# EAGLE design E6_main (EAGLE 7.0.0)
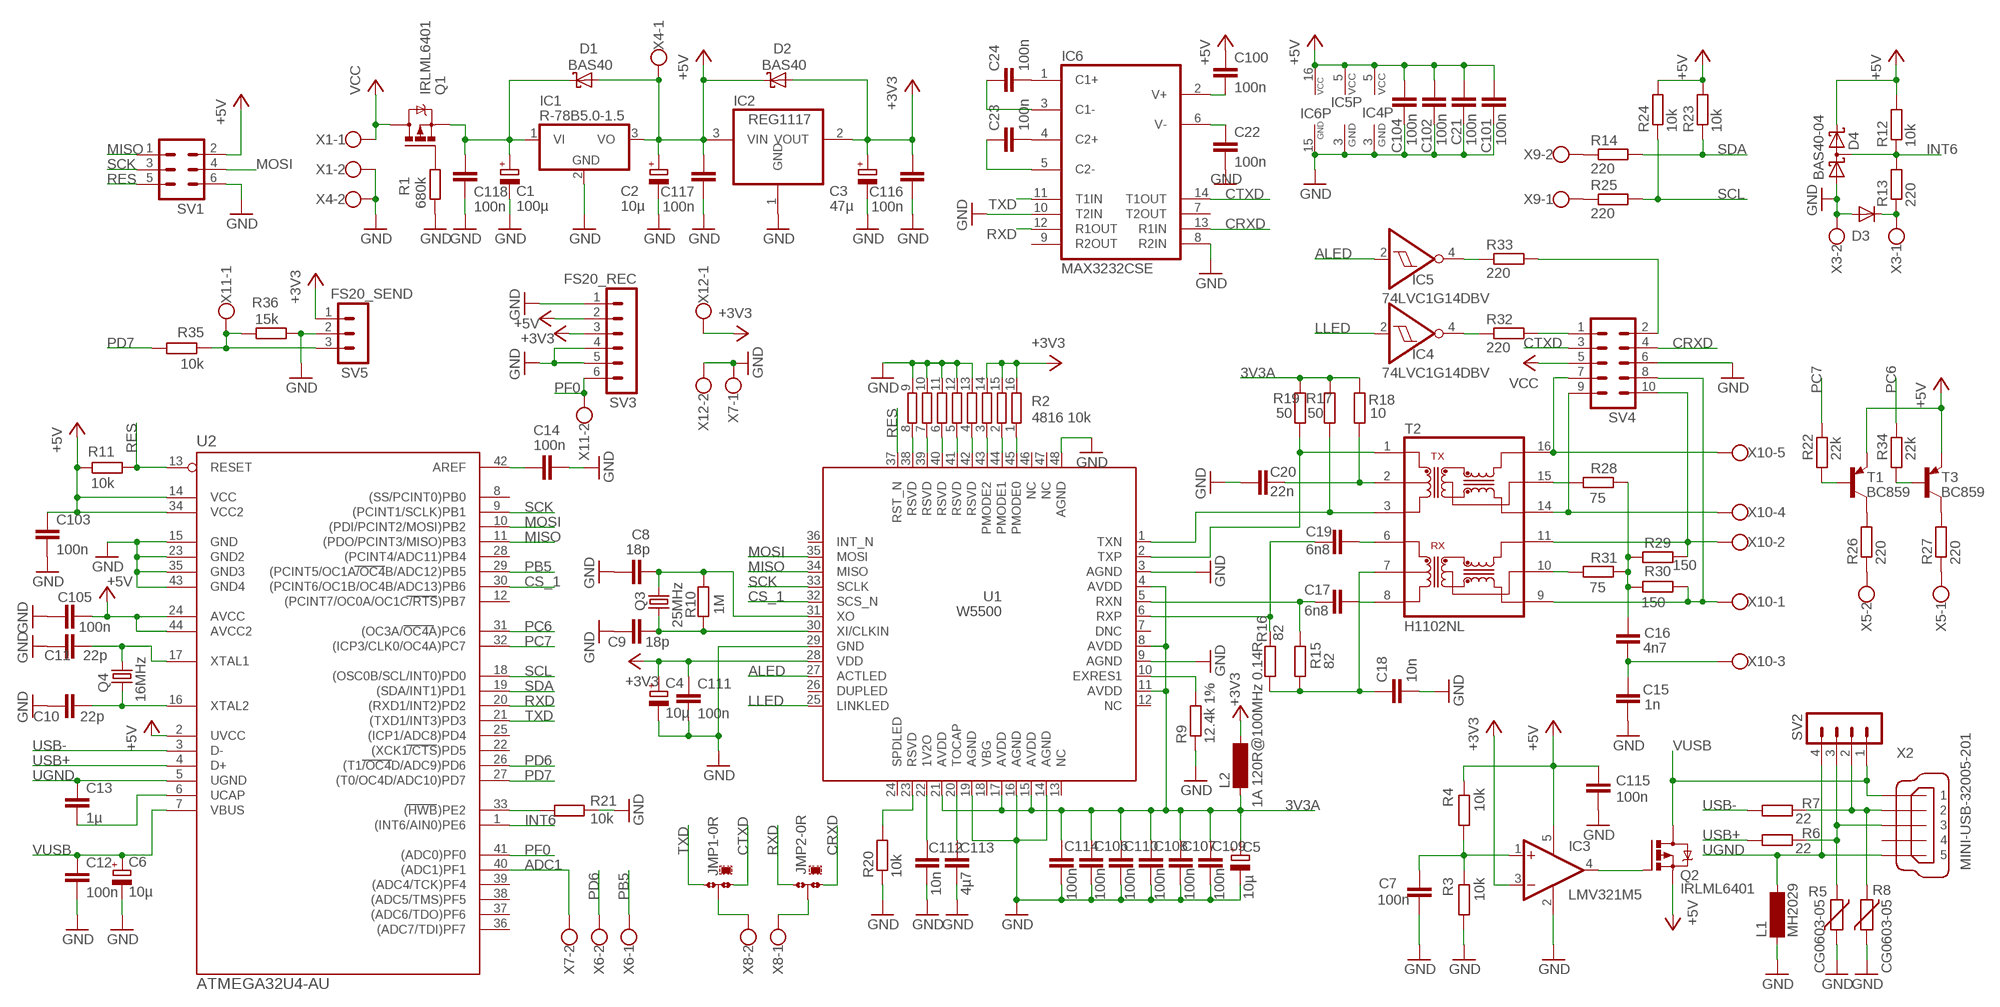
[diagram p0: schematic, sheet 1]

## Parts
C1  100µ  CPOL-EUE2.5-7  [E2,5-7]
C2  10µ  CPOL-EUE2-5  [E2-5]
C3  47µ  CPOL-EUE2-5  [E2-5]
C4  10µ  CPOL-EUE2-5  [E2-5]
C5  10µ  CPOL-EUE2-5  [E2-5]
C6  10µ  CPOL-EUE2-5  [E2-5]
C7  100n  C-EUC0805K  [C0805K]
C8  18p  C-EUC0805K  [C0805K]
C9  18p  C-EUC0805K  [C0805K]
C10  22p  C-EUC0805K  [C0805K]
C11  22p  C-EUC0805K  [C0805K]
C12  100n  C-EUC0805K  [C0805K]
C13  1µ  C-EUC0805K  [C0805K]
C14  100n  C-EUC0805K  [C0805K]
C15  1n  C-EUC0805K  [C0805K]
C16  4n7  C-EUC0805K  [C0805K]
C17  6n8  C-EUC0805K  [C0805K]
C18  10n  C-EUC0805K  [C0805K]
C19  6n8  C-EUC0805K  [C0805K]
C20  22n  C-EUC0805K  [C0805K]
C21  100n  C-EUC0805K  [C0805K]
C22  100n  C-EUC0805K  [C0805K]
C23  100n  C-EUC0805K  [C0805K]
C24  100n  C-EUC0805K  [C0805K]
C100  100n  C-EUC0805K  [C0805K]
C101  100n  C-EUC0805K  [C0805K]
C102  100n  C-EUC0805K  [C0805K]
C103  100n  C-EUC0805K  [C0805K]
C104  100n  C-EUC0805K  [C0805K]
C105  100n  C-EUC0805K  [C0805K]
C106  100n  C-EUC0805K  [C0805K]
C107  100n  C-EUC0805K  [C0805K]
C108  100n  C-EUC0805K  [C0805K]
C109  100n  C-EUC0805K  [C0805K]
C110  100n  C-EUC0805K  [C0805K]
C111  100n  C-EUC0805K  [C0805K]
C112  10n  C-EUC0805K  [C0805K]
C113  4µ7  C-EUC0805K  [C0805K]
C114  100n  C-EUC0805K  [C0805K]
C115  100n  C-EUC0805K  [C0805K]
C116  100n  C-EUC0805K  [C0805K]
C117  100n  C-EUC0805K  [C0805K]
C118  100n  C-EUC0805K  [C0805K]
D1  BAS40  [SOT23]
D2  BAS40  [SOT23]
D3  DIODE-SOT54H  [SOT54H]
D4  BAS40-04  [SOT23]
IC1  R-78B5.0-1.5  7805TV  [TO220V]
IC2  REG1117  [SOT223]
IC3  LMV321M5  [SOT23-5]
IC4  74LVC1G14DBV  [SOT23-5]
IC5  74LVC1G14DBV  [SOT23-5]
IC6  MAX3232CSE  [SO16]
JMP1  0R-JUMPA  [A0R-JMP]
JMP2  0R-JUMPA  [A0R-JMP]
L1  MH2029  SM-1206  [SM-1206]
L2  1A 120R@100MHz 0.14R  SM-1206  [SM-1206]
Q1  IRLML6401  IRLML5203  [MICRO3]
Q2  IRLML6401  IRLML5203  [MICRO3]
Q3  25MHz  CRYSTALHC49S  [HC49/S]
Q4  16MHz  CRYSTALHC49S  [HC49/S]
R1  680k  R-EU_R0805  [R0805]
R2  4816 10k  4816P-T01  [4816P]
R3  10k  R-EU_R0805  [R0805]
R4  10k  R-EU_R0805  [R0805]
R5  CG0603-05  VARISTORCN0603  [CT/CN0603]
R6  22  R-EU_R0805  [R0805]
R7  22  R-EU_R0805  [R0805]
R8  CG0603-05  VARISTORCN0603  [CT/CN0603]
R9  12.4k 1%  R-EU_R0805  [R0805]
R10  1M  R-EU_R0805  [R0805]
R11  10k  R-EU_R0805  [R0805]
R12  10k  R-EU_R0805  [R0805]
R13  220  R-EU_R0805  [R0805]
R14  220  R-EU_R0805  [R0805]
R15  82  R-EU_R0805  [R0805]
R16  82  R-EU_R0805  [R0805]
R17  50  R-EU_R0805  [R0805]
R18  10  R-EU_R0805  [R0805]
R19  50  R-EU_R0805  [R0805]
R20  10k  R-EU_R0805  [R0805]
R21  10k  R-EU_R0805  [R0805]
R22  22k  R-EU_R0805  [R0805]
R23  10k  R-EU_R0805  [R0805]
R24  10k  R-EU_R0805  [R0805]
R25  220  R-EU_R0805  [R0805]
R26  220  R-EU_R0805  [R0805]
R27  220  R-EU_R0805  [R0805]
R28  75  R-EU_R0805  [R0805]
R29  150  R-EU_R0805  [R0805]
R30  150  R-EU_R0805  [R0805]
R31  75  R-EU_R0805  [R0805]
R32  220  R-EU_R0805  [R0805]
R33  220  R-EU_R0805  [R0805]
R34  22k  R-EU_R0805  [R0805]
R35  10k  R-EU_R0805  [R0805]
R36  15k  R-EU_R0805  [R0805]
SV1  ML6  [ML6]
SV2  MA04-1  [MA04-1]
SV3  FS20_REC  MA06-1  [MA06-1]
SV4  ML10  [ML10]
SV5  FS20_SEND  MA03-1  [MA03-1]
T1  BC859  BC857A-PNP-SOT23-BEC  [SOT23-BEC]
T2  H1102NL  HX1188  [HXXXX]
T3  BC859  BC857A-PNP-SOT23-BEC  [SOT23-BEC]
U1  W5500  [W5500]
U2  ATMEGA32U4-AU  [TQFP44]
X1  W237-02P  [W237-132]
X2  MINI-USB-32005-201  [32005-201]
X3  W237-02P  [W237-132]
X4  W237-02P  [W237-132]
X5  W237-02P  [W237-132]
X6  W237-02P  [W237-132]
X7  W237-02P  [W237-132]
X8  W237-02P  [W237-132]
X9  W237-02P  [W237-132]
X10  W237-05P  [W237-5P]
X11  W237-02P  [W237-132]
X12  W237-02P  [W237-132]

## Nets
3V3A: C5.+ C106.1 C107.1 C108.1 C109.1 C110.1 C114.1 L2.1 R17.2 R18.2 R19.2 U1.4(AVDD) U1.8(AVDD) U1.11(AVDD) U1.15(AVDD) U1.17(AVDD) U1.21(AVDD)
+3V3: C3.+ C4.+ C111.1 C116.2 D2.1(A) IC2.2(VOUT) IC3.3(-IN) L2.2 R2.14 R2.15 R2.16 SV3.3 SV5.1 U1.28(VDD) X12.1
+5V: C2.+ C21.1 C100.1 C101.1 C102.2 C103.1 C104.2 C105.1 C115.2 C117.2 D1.1(A) D2.3(C) D4.2(C2) IC1.3(VO) IC2.3(VIN) IC3.5(V+) IC4.5(VCC) IC5.5(VCC) IC6.16(VCC) Q2.2(S) R4.1 R11.2 R12.2 R23.2 R24.2 SV1.2 SV3.2 T1.E T3.E U2.2(UVCC) U2.14(VCC) U2.24(AVCC) U2.34(VCC2) U2.44(AVCC2) X4.1
ADC1: U2.40((ADC1)PF1) X7.2
ALED: IC5.2(I) U1.27(ACTLED)
CRXD: IC6.13(R1IN) JMP2.1 SV4.4
CS_1: U1.32(SCS_N) U2.30((PCINT6/OC1B/OC4B/ADC13)PB6)
CTXD: IC6.14(T1OUT) JMP1.1 SV4.3
GND: C1.- C2.- C3.- C4.- C5.- C6.- C7.2 C8.1 C9.2 C10.2 C11.1 C12.2 C14.2 C15.1 C18.2 C20.1 C21.2 C22.2 C101.2 C102.1 C103.2 C104.1 C105.2 C106.2 C107.2 C108.2 C109.2 C110.2 C111.2 C112.2 C113.2 C114.2 C115.1 C116.1 C117.1 C118.2 D3.A D4.1(A1) IC1.2(GND) IC2.1(GND) IC3.2(V-) IC4.3(GND) IC5.3(GND) IC6.8(R2IN) IC6.10(T2IN) IC6.15(GND) L1.1 R1.2 R2.9 R2.10 R2.11 R2.12 R2.13 R3.2 R5.2 R8.2 R9.1 R20.1 R21.2 R36.1 SV1.6 SV3.1 SV3.4 SV3.5 SV4.6 SV5.2 U1.3(AGND) U1.9(AGND) U1.14(AGND) U1.16(AGND) U1.19(AGND) U1.29(GND) U1.48(AGND) U2.15(GND) U2.23(GND2) U2.35(GND3) U2.43(GND4) X1.2 X3.2 X4.2 X7.1 X12.2
INT6: D4.3(C1A2) R12.1 R13.2 U2.1((INT6/AIN0)PE6)
LLED: IC4.2(I) U1.25(LINKLED)
MISO: SV1.1 U1.34(MISO) U2.11((PDO/PCINT3/MISO)PB3)
MOSI: SV1.4 U1.35(MOSI) U2.10((PDI/PCINT2/MOSI)PB2)
N$1: C10.1 Q4.2 U2.16(XTAL2)
N$2: C11.2 Q4.1 U2.17(XTAL1)
N$3: C17.1 R15.1 U1.5(RXN)
N$4: C1.+ C118.1 D1.3(C) IC1.1(VI) Q1.2(S)
N$5: C113.1 U1.20(TOCAP)
N$6: C19.1 R16.1 U1.6(RXP)
N$7: C9.1 Q3.2 R10.2 U1.30(XI/CLKIN)
N$8: R35.1 R36.2 SV5.3 X11.1
N$9: JMP1.2 X8.2
N$10: C20.2 R18.1 T2.2
N$11: Q1.1(G) R1.1
N$12: C8.2 Q3.1 R10.1 U1.31(XO)
N$13: R19.1 T2.1 U1.2(TXP)
N$14: R2.8 U1.38(RSVD)
N$15: R20.2 U1.23(RSVD)
N$16: C18.1 R15.2 R16.2 T2.7
N$17: R17.1 T2.3 U1.1(TXN)
N$18: C19.2 T2.6
N$19: SV4.7 T2.16 X10.5
N$20: C112.1 U1.22(1V2O)
N$21: SV4.9 T2.14 X10.4
N$22: R29.1 SV4.10 T2.11 X10.2
N$23: R28.2 T2.15
N$24: C15.2 C16.1 X10.3
N$25: R2.7 U1.39(RSVD)
N$26: JMP2.2 X8.1
N$27: R33.2 SV4.2
N$28: R9.2 U1.10(EXRES1)
N$29: C14.1 U2.42(AREF)
N$30: R2.6 U1.40(RSVD)
N$31: R2.5 U1.41(RSVD)
N$32: R2.4 U1.42(RSVD)
N$33: C17.2 T2.8
N$34: R2.3 U1.43(PMODE2)
N$35: R2.2 U1.44(PMODE1)
N$36: R2.1 U1.45(PMODE0)
N$37: C16.2 R28.1 R29.2 R30.2 R31.1
N$38: D3.C R13.1 X3.1
N$39: R31.2 T2.10
N$40: R30.1 SV4.8 T2.9 X10.1
N$41: IC5.4(O) R33.1
N$42: IC4.4(O) R32.1
N$43: R21.1 U2.33((HWB)PE2)
N$44: R26.1 X5.2
N$45: R32.2 SV4.1
N$46: R27.1 X5.1
N$48: C24.1 IC6.3(C1-)
N$49: R7.1 R8.1 SV2.2 X2.2
N$50: C24.2 IC6.1(C1+)
N$51: C23.2 IC6.4(C2+)
N$52: C23.1 IC6.5(C2-)
N$53: C22.1 IC6.6(V-)
N$54: C100.2 IC6.2(V+)
N$55: R26.2 T1.C
N$56: R5.1 R6.1 SV2.3 X2.3
N$57: R27.2 T3.C
N$58: R22.1 T1.B
N$59: R34.1 T3.B
N$61: C13.2 U2.6(UCAP)
N$63: C7.1 IC3.1(+IN) R3.1 R4.2
N$67: IC3.4(OUT) Q2.1(G)
N$173: R14.1 X9.2
N$178: R25.1 X9.1
PB5: U2.29((PCINT5/OC1A/OC4B/ADC12)PB5) X6.1
PC6: R34.2 U2.31((OC3A/OC4A)PC6)
PC7: R22.2 U2.32((ICP3/CLK0/OC4A)PC7)
PD6: U2.26((T1/OC4D/ADC9)PD6) X6.2
PD7: R35.2 U2.27((T0/OC4D/ADC10)PD7)
PF0: SV3.6 U2.41((ADC0)PF0) X11.2
RES: R11.1 SV1.5 U1.37(RST_N) U2.13(RESET)
RXD: IC6.12(R1OUT) JMP2.3 U2.20((RXD1/INT2)PD2)
SCK: SV1.3 U1.33(SCLK) U2.9((PCINT1/SCLK)PB1)
SCL: R24.1 R25.2 U2.18((OSC0B/SCL/INT0)PD0)
SDA: R14.2 R23.1 U2.19((SDA/INT1)PD1)
TXD: IC6.11(T1IN) JMP1.3 U2.21((TXD1/INT3)PD3)
UGND: C13.1 L1.2 SV2.4 U2.5(UGND) X2.5
USB+: R6.2 U2.4(D+)
USB-: R7.2 U2.3(D-)
VCC: Q1.3(D) SV4.5 X1.1
VUSB: C6.+ C12.1 Q2.3(D) SV2.1 U2.7(VBUS) X2.1
Unconnected: IC6.7(T2OUT) IC6.9(R2OUT) U1.7(DNC) U1.12(NC) U1.13(NC) U1.18(VBG) U1.24(SPDLED) U1.26(DUPLED) U1.36(INT_N) U1.46(NC) U1.47(NC) U2.8((SS/PCINT0)PB0) U2.12((PCINT7/OC0A/OC1C/RTS)PB7) U2.22((XCK1/CTS)PD5) U2.25((ICP1/ADC8)PD4) U2.28((PCINT4/ADC11)PB4) U2.36((ADC7/TDI)PF7) U2.37((ADC6/TDO)PF6) U2.38((ADC5/TMS)PF5) U2.39((ADC4/TCK)PF4) X2.4

## Library data of the parts
C1-C6 = rcl:CPOL-EU: POLARIZED CAPACITOR, European symbol
C7-C24 C100-C118 = rcl:C-EU: CAPACITOR, European symbol
D1 D2 = diode:BAS40: Silicon Schottky Diodes General-purpose diode for high-speed switching
D3 = diode:DIODE-: DIODE
D4 = diode:BAS40-04: Silicon Schottky Diodes General-purpose diode for high-speed switching
IC1 = linear:78*: Positive VOLTAGE REGULATOR Source: http://cache.national.com/ds/LM/LM78L05.pdf http://www.fairchildsemi.com/ds/LM/LM7805.pdf
IC2 = burr-brown:REG1117: 800mA and 1A Low Dropout (LDO) Positive Regulator 1.8V, 2.5V, 2.85V, 3.3V, 5V, and Adj
IC3 = linear:LMV321?*: General Purpose, Low Voltage, Rail-to-Rail Output Operational Amplifiers Source: http://www.national.com/mpf/LM/LMV321.html http://www.national.com/dt/lmv_qual.pdf
IC4 IC5 = 74xx-little-de:74*1G14: Single Schmitt-Trigger Inverter Gate
IC6 = maxim:MAX3232*: True RS-232 Transceivers 3.0V to 5.5V, Low-Power up to 1Mbps, Using Four 0.1µF External Capacitors Source: http://pdfserv.maxim-ic.com/en/ds/MAX3222-MAX3241.pdf
JMP1 JMP2 = jump-0r-smd:0R-JUMP: SMD 0R 0805 Jumper
L1 L2 = inductor-neosid:SM-1206: INDUCTOR SMD chip inductor; OC_FARNELL: unknown; OC_NEWARK: unknown
Q1 Q2 = transistor-power:IRLML5203: HEXFET P-Channel Power MOSFET
Q3 Q4 = crystal:CRYSTAL: CRYSTAL
R1 R3 R4 R6 R7 R9-R36 = rcl:R-EU_: RESISTOR, European symbol
R2 = resistor-bourns:4816P-T01: BOURNS RESISTOR NETWORK; MF: BOURNS, INC.; MPN: 4816P-T01-684LF; OC_FARNELL: 9357483; OC_NEWARK: 33K0707
R5 R8 = varistor:VARISTOR: VARISTOR
SV1 = con-ml:ML6: HARTING
SV2 = con-lstb:MA04-1: PIN HEADER; OC_FARNELL: unknown; OC_NEWARK: unknown
SV3 = con-lstb:MA06-1: PIN HEADER
SV4 = con-harting-ml:ML10: HARTING
SV5 = con-lstb:MA03-1: PIN HEADER
T1 T3 = transistor:*-PNP-: PNP Transistror
T2 = pulse-eng:HX1188: Transformer- H110X, H1121, HX1188
U1 = W5500:W5500
U2 = mega32U4:ATMEGA32U4-AU: ATMega32U4-AU Library by: http://projects.weber-itam.de
X1 X3-X9 X11 X12 = con-wago-508:W237-02P: WAGO SREW CLAMP
X2 = con-cypressindustries:MINI-USB-: MINI USB-B Conector Source: www.cypressindustries.com; OC_FARNELL: unknown; OC_NEWARK: unknown
X10 = con-wago-508:W237-05P: WAGO SREW CLAMP

## Board
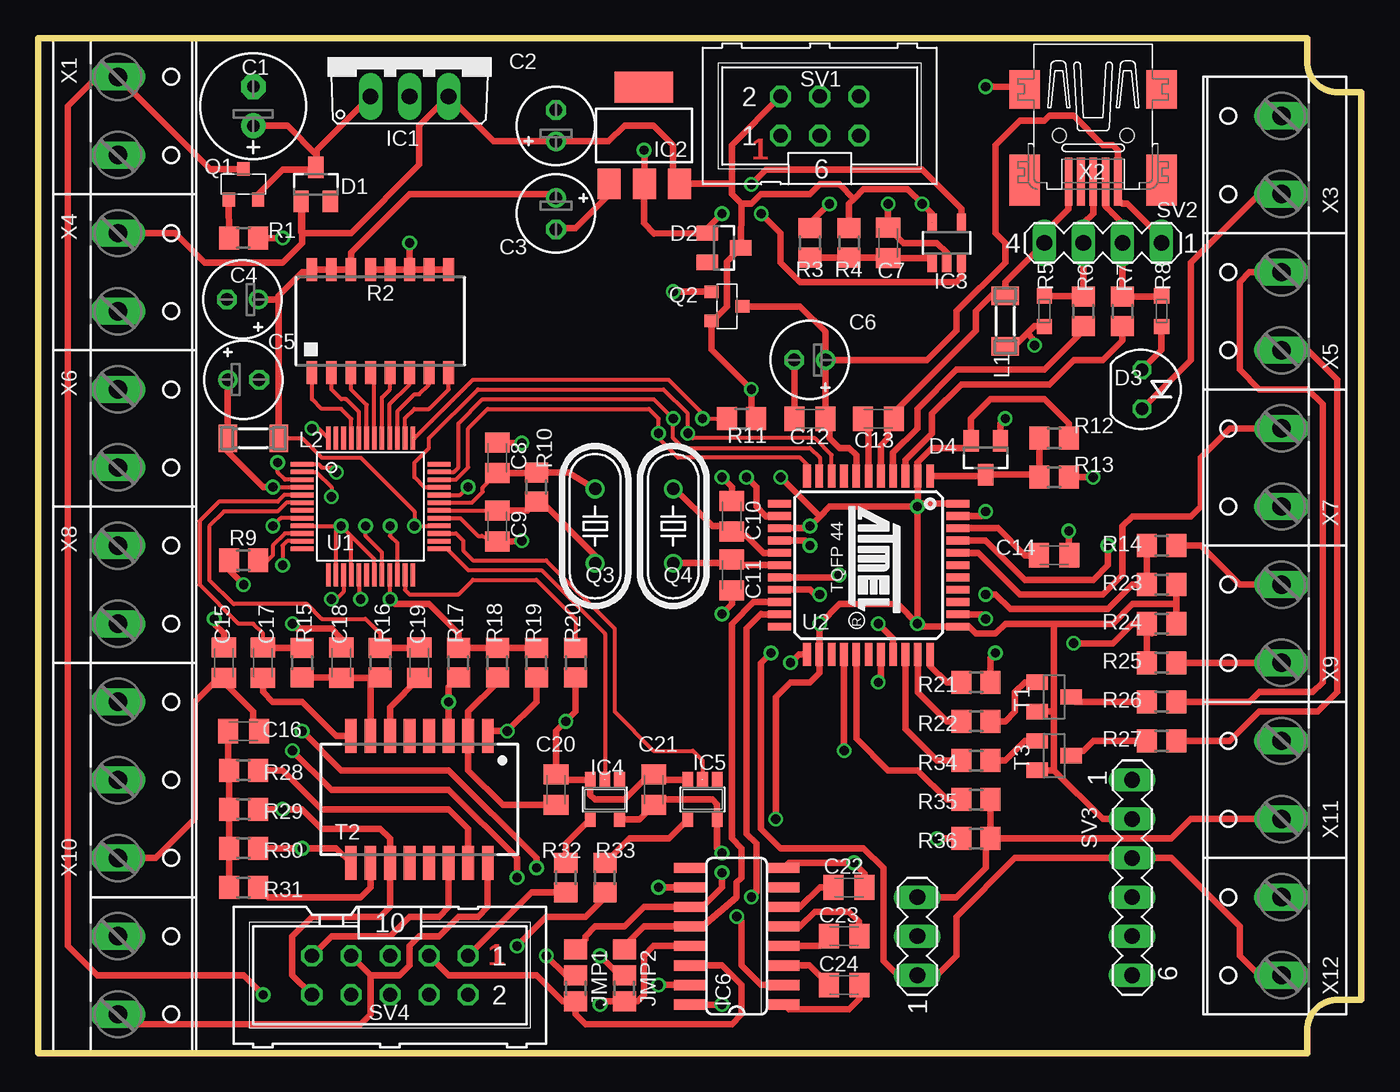
[diagram p1: board, top side]
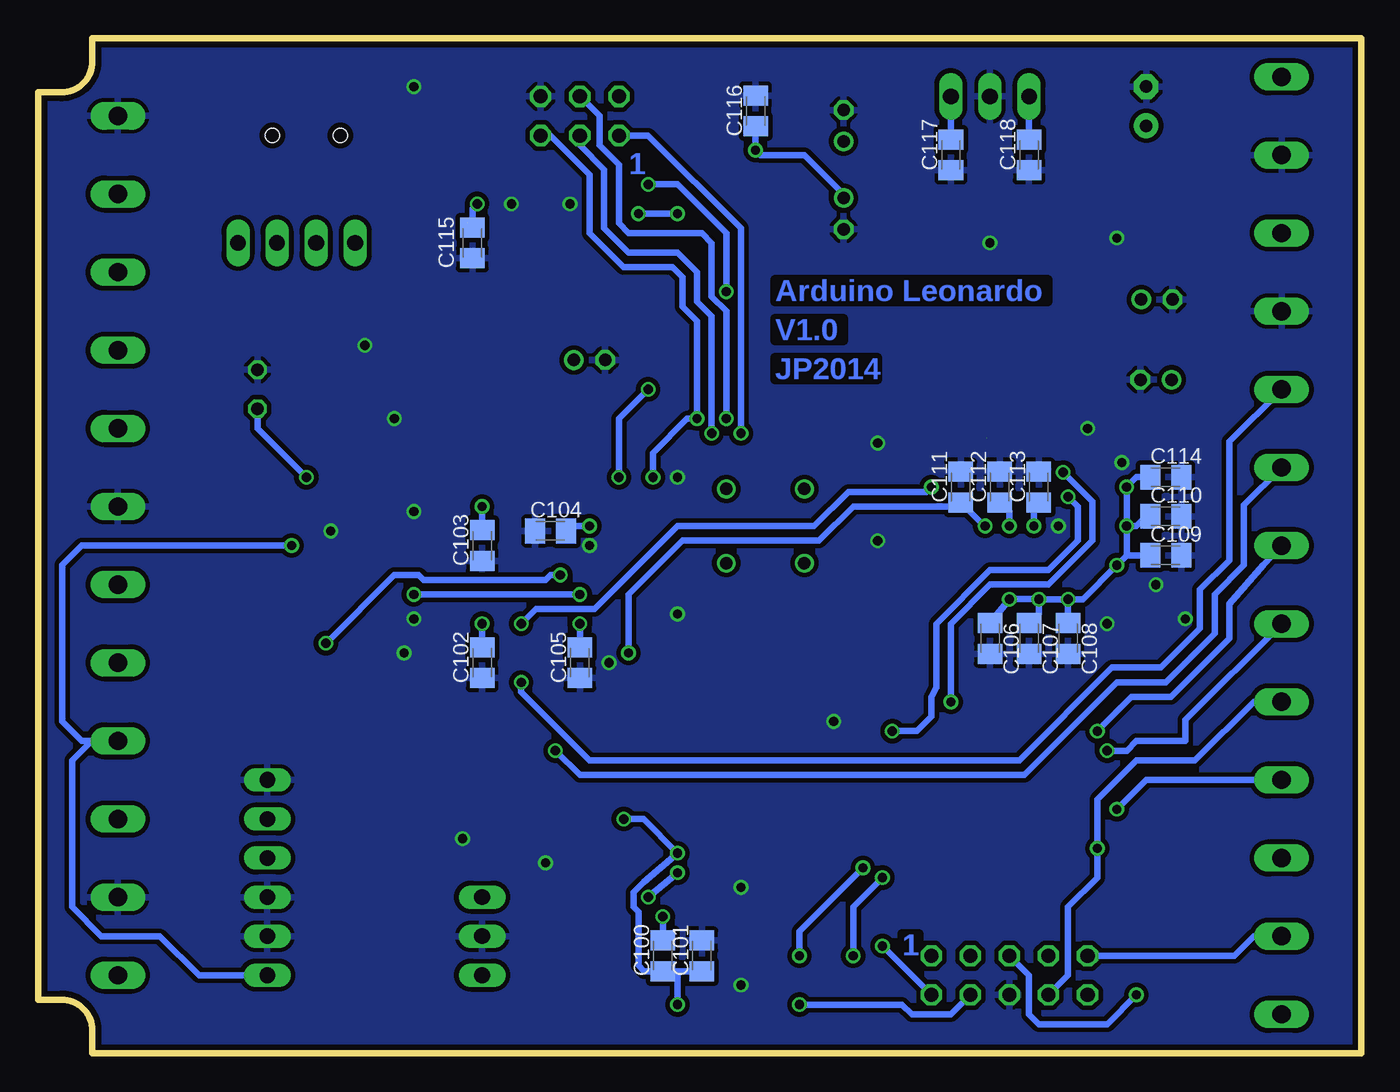
[diagram p2: board, bottom side, seen from below]

Size 86 x 66 mm. Coordinates in mm from the lower left corner, seen from the top.
Outline: 82.5,66 0,66 0,0 82.5,0 82.5,1.5 arc-90 84.5,3.5 86,3.5 86,62.5 84.5,62.5 arc-90 82.5,64.5 82.5,66
Copper layers (1*16): Top 0.0356mm / dielectric 1.5011mm / Bottom 0.0356mm
Design rules "LaenPCBOrder *": minimum track width 6mil, minimum drill 13mil, track to track 6mil, track to pad 6mil, pad to pad 6mil, via to via 6mil, smd to smd 6mil, copper to edge 15mil, drill to drill 6mil, minimum pad ring 7mil, minimum via ring 7mil, stop-mask expansion 3mil, vias tented up to drill 0mil, thermal gap 10mil
bKeepout: area 26,60 to 30,64; area 45,60 to 49,64; area 41,2 to 45,6; area 26,2 to 30,6

### Footprints (pad centres in the part's own frame; a part is rotated, then mirrored left to right if it is on the bottom)
E2,5-7 = drill 0.813 pad 1.6: + -1.27,0 | drill 0.813 pad 1.6 octagon: - 1.27,0
E2-5 = drill 0.813 pad 1.27: + -1.016,0 | drill 0.813 pad 1.27 octagon: - 1.016,0
C0805K = smd 1.3 x 1.6: 1 -1,0; 2 1,0
SOT23 = smd 1 x 1.4: 1 -0.95,-1.1; 2 0.95,-1.1; 3 0,1.1
SOT54H = drill 0.813 octagon: A 1.27,0; C -1.27,0
TO220V = drill 1.016 long: 1 -2.54,-2.54; 2 0,-2.54; 3 2.54,-2.54
SOT223 = smd 1.499 x 2.007: 1 -2.261,-3.15; 2 0.025,-3.15; 3 2.311,-3.15 | smd 3.81 x 2.007: 4 0,3.15
SOT23-5 = smd 0.6 x 1.2: 1 -0.95,-1.306; 2 0,-1.306; 3 0.95,-1.306; 4 0.95,1.306; 5 -0.95,1.306
SOT23-5' = smd 0.69 x 0.99: 1 -0.95,-1.29; 2 0,-1.29; 3 0.95,-1.29; 4 0.95,1.3; 5 -0.95,1.3
SO16 = smd 0.66 x 2.032: 1 -4.445,-3.073; 2 -3.175,-3.073; 3 -1.905,-3.073; 4 -0.635,-3.073; 5 0.635,-3.073; 6 1.905,-3.073; 7 3.175,-3.073; 8 4.445,-3.073; 9 4.445,3.073; 10 3.175,3.073; 11 1.905,3.073; 12 0.635,3.073; 13 -0.635,3.073; 14 -1.905,3.073; 15 -3.175,3.073; 16 -4.445,3.073
A0R-JMP = smd 1.5 x 1.3: 1 0,1.7; 2 0,0; 3 0,-1.7
SM-1206 = smd 1.2 x 1.8: 1 -1.65,0; 2 1.65,0
MICRO3 = smd 0.8 x 0.9: 1 -0.95,-1; 2 0.95,-1; 3 0,1
HC49/S = drill 0.813: 1 -2.413,0; 2 2.413,0
R0805 = smd 1.3 x 1.5: 1 -0.95,0; 2 0.95,0
4816P = smd 0.7 x 1.5: 1 -4.445,-3.346; 2 -3.175,-3.346; 3 -1.905,-3.346; 4 -0.635,-3.346; 5 0.635,-3.346; 6 1.905,-3.346; 7 3.175,-3.346; 8 4.445,-3.346; 9 4.445,3.346; 10 3.175,3.346; 11 1.905,3.346; 12 0.635,3.346; 13 -0.635,3.346; 14 -1.905,3.346; 15 -3.175,3.346; 16 -4.445,3.346
CT/CN0603 = smd 1 x 1: 1 -1,0; 2 1,0
ML6 = drill 0.914 octagon: 1 -2.54,-1.27; 2 -2.54,1.27; 3 0,-1.27; 4 0,1.27; 5 2.54,-1.27; 6 2.54,1.27
MA04-1 = drill 1.016 long: 1 -3.81,0; 2 -1.27,0; 3 1.27,0; 4 3.81,0
MA06-1 = drill 1.016 long: 1 -6.35,0; 2 -3.81,0; 3 -1.27,0; 4 1.27,0; 5 3.81,0; 6 6.35,0
ML10 = drill 0.914 octagon: 1 -5.08,-1.27; 2 -5.08,1.27; 3 -2.54,-1.27; 4 -2.54,1.27; 5 0,-1.27; 6 0,1.27; 7 2.54,-1.27; 8 2.54,1.27; 9 5.08,-1.27; 10 5.08,1.27
MA03-1 = drill 1.016 long: 1 -2.54,0; 2 0,0; 3 2.54,0
SOT23-BEC = smd 1 x 1.4: B -0.95,-1.1; C 0,1.1; E 0.95,-1.1
HXXXX = smd 0.76 x 2.2: 1 -4.445,-4.128; 2 -3.175,-4.128; 3 -1.905,-4.128; 4 -0.635,-4.128; 5 0.635,-4.128; 6 1.905,-4.128; 7 3.175,-4.128; 8 4.445,-4.128; 9 4.445,4.128; 10 3.175,4.128; 11 1.905,4.128; 12 0.635,4.128; 13 -0.635,4.128; 14 -1.905,4.128; 15 -3.175,4.128; 16 -4.445,4.128
W5500 = smd 1.5 x 0.3: 1 -4.45,2.75; 2 -4.45,2.25; 3 -4.45,1.75; 4 -4.45,1.25; 5 -4.45,0.75; 6 -4.45,0.25; 7 -4.45,-0.25; 8 -4.45,-0.75; 9 -4.45,-1.25; 10 -4.45,-1.75; 11 -4.45,-2.25; 12 -4.45,-2.75; 25 4.45,-2.75; 26 4.45,-2.25; 27 4.45,-1.75; 28 4.45,-1.25; 29 4.45,-0.75; 30 4.45,-0.25; 31 4.45,0.25; 32 4.45,0.75; 33 4.45,1.25; 34 4.45,1.75; 35 4.45,2.25; 36 4.45,2.75 | smd 0.3 x 1.5: 13 -2.75,-4.45; 14 -2.25,-4.45; 15 -1.75,-4.45; 16 -1.25,-4.45; 17 -0.75,-4.45; 18 -0.25,-4.45; 19 0.25,-4.45; 20 0.75,-4.45; 21 1.25,-4.45; 22 1.75,-4.45; 23 2.25,-4.45; 24 2.75,-4.45; 37 2.75,4.45; 38 2.25,4.45; 39 1.75,4.45; 40 1.25,4.45; 41 0.75,4.45; 42 0.25,4.45; 43 -0.25,4.45; 44 -0.75,4.45; 45 -1.25,4.45; 46 -1.75,4.45; 47 -2.25,4.45; 48 -2.75,4.45
TQFP44 = smd 1.5 x 0.5: 1 -5.8,4; 2 -5.8,3.2; 3 -5.8,2.4; 4 -5.8,1.6; 5 -5.8,0.8; 6 -5.8,0; 7 -5.8,-0.8; 8 -5.8,-1.6; 9 -5.8,-2.4; 10 -5.8,-3.2; 11 -5.8,-4; 23 5.8,-4; 24 5.8,-3.2; 25 5.8,-2.4; 26 5.8,-1.6; 27 5.8,-0.8; 28 5.8,0; 29 5.8,0.8; 30 5.8,1.6; 31 5.8,2.4; 32 5.8,3.2; 33 5.8,4 | smd 0.5 x 1.5: 12 -4,-5.8; 13 -3.2,-5.8; 14 -2.4,-5.8; 15 -1.6,-5.8; 16 -0.8,-5.8; 17 0,-5.8; 18 0.8,-5.8; 19 1.6,-5.8; 20 2.4,-5.8; 21 3.2,-5.8; 22 4,-5.8; 34 4,5.8; 35 3.2,5.8; 36 2.4,5.8; 37 1.6,5.8; 38 0.8,5.8; 39 0,5.8; 40 -0.8,5.8; 41 -1.6,5.8; 42 -2.4,5.8; 43 -3.2,5.8; 44 -4,5.8
W237-132 = drill 1.194 long: 1 -2.54,-0.635; 2 2.54,-0.635
32005-201 = smd 3.1 x 0.5: 1 3,1.6; 2 3,0.8; 3 3,0; 4 3,-0.8; 5 3,-1.6 | smd 2.5 x 2: M1 -3,-4.45; M2 -3,4.45 | smd 3.3 x 2: M3 2.9,4.45; M4 2.9,-4.45 | hole 0.9: 0,2.2; 0,-2.2
W237-5P = drill 1.194 long: 1 -10.16,-0.635; 2 -5.08,-0.635; 3 0,-0.635; 4 5.08,-0.635; 5 10.16,-0.635

### Placement (x,y rotation side)
C1  13.97,61.59 90 top
C2  33.66,60.33 90 top
C3  33.66,54.61 270 top
C4  13.27,49.02 180 top
C5  13.34,43.81 0 top
C6  50.16,45.09 180 top
C7  55.24,52.7 90 top
C8  29.84,38.73 270 top
C9  29.84,34.29 270 top
C10  45.09,34.92 90 top
C11  45.09,31.11 90 top
C12  50.16,41.27 180 top
C13  54.61,41.27 180 top
C14  66.04,32.38 0 top
C15  12.06,25.4 270 top
C16  13.34,20.95 180 top
C17  14.61,25.4 270 top
C18  19.68,25.4 90 top
C19  24.77,25.4 270 top
C20  33.66,17.14 270 top
C21  40.01,17.14 90 top
C22  52.7,10.79 0 top
C23  52.39,7.62 180 top
C24  52.39,4.45 0 top
C100  45.4,6.35 90 bottom
C101  42.86,6.35 90 bottom
C102  57.15,25.4 90 bottom
C103  57.15,33.02 270 bottom
C104  52.7,33.97 0 bottom
C105  50.8,25.4 270 bottom
C106  24.13,26.99 270 bottom
C107  21.59,26.99 270 bottom
C108  19.05,26.99 270 bottom
C109  12.7,32.38 0 bottom
C110  12.7,34.92 0 bottom
C111  26.04,36.83 90 bottom
C112  23.5,36.83 90 bottom
C113  20.95,36.83 90 bottom
C114  12.7,37.47 0 bottom
C115  57.78,52.7 90 bottom
C116  39.37,61.28 270 bottom
C117  26.67,58.42 90 bottom
C118  21.59,58.42 270 bottom
D1  18.03,56.52 0 top
D2  44.58,52.39 270 top
D3  71.75,43.18 90 top
D4  61.59,38.73 180 top
IC1  24.13,64.77 0 top
IC2  39.37,59.69 0 top
IC3  59.05,52.7 0 top
IC4  74LVC1G14DBV  [SOT23-5']  36.83,16.51 180 top
IC5  74LVC1G14DBV  [SOT23-5']  43.18,16.51 180 top
IC6  45.4,7.62 90 top
JMP1  34.92,5.08 180 top
JMP2  38.1,5.08 180 top
L1  62.87,47.62 90 top
L2  13.97,40.01 0 top
Q1  13.34,56.52 0 top
Q2  44.77,48.58 270 top
Q3  36.2,34.29 270 top
Q4  41.27,34.29 90 top
R1  13.34,53.02 0 top
R2  22.23,47.62 0 top
R3  50.16,52.7 90 top
R4  52.7,52.7 270 top
R5  65.41,48.26 270 top
R6  67.94,48.26 270 top
R7  70.48,48.26 270 top
R8  73.03,48.26 270 top
R9  13.34,32.07 0 top
R10  32.38,36.83 270 top
R11  45.72,41.27 0 top
R12  66.04,40.01 0 top
R13  66.04,37.47 180 top
R14  73.03,33.02 180 top
R15  17.14,25.4 270 top
R16  22.23,25.4 270 top
R17  27.3,25.4 90 top
R18  29.84,25.4 90 top
R19  32.38,25.4 90 top
R20  34.92,25.4 90 top
R21  60.96,24.13 0 top
R22  60.96,21.59 180 top
R23  73.03,30.48 0 top
R24  73.03,27.94 0 top
R25  73.03,25.4 180 top
R26  73.03,22.86 180 top
R27  73.03,20.32 180 top
R28  13.34,18.41 0 top
R29  13.34,15.88 180 top
R30  13.34,13.34 180 top
R31  13.34,10.79 0 top
R32  34.29,11.43 270 top
R33  36.83,11.43 270 top
R34  60.96,19.05 180 top
R35  60.96,16.51 180 top
R36  60.96,13.97 0 top
SV1  50.8,60.96 0 top
SV2  69.22,52.7 180 top
SV3  71.12,11.43 270 top
SV4  22.86,5.08 180 top
SV5  57.15,7.62 90 top
T1  66.04,23.18 270 top
T2  24.77,16.51 180 top
T3  66.04,19.37 270 top
U1  21.59,35.56 0 top
U2  53.98,31.75 270 top
X1  5.8,60.96 270 top
X2  68.58,59.69 270 top
X3  80.2,58.42 90 top
X4  5.8,50.8 270 top
X5  80.2,48.26 90 top
X6  5.8,40.64 270 top
X7  80.2,38.1 90 top
X8  5.8,30.48 270 top
X9  80.2,27.94 90 top
X10  5.8,12.7 270 top
X11  80.2,17.78 90 top
X12  80.2,7.62 90 top

### Tracks (layer width: path | path; a pad name or v marks a point on that pad's centre or on a via)
3V3A  (via drill 0.6)
  Top 0.254: U1.4 15.58,36.81 v15.24,36.83 | U1.15 19.84,30 19.37,29.53 v19.05,29.53 | U1.17 20.84,29.64 v20.95,29.53 | U1.11 16.16,33.31 15.88,33.02 v15.88,31.75 | U1.8 15.76,34.81 v15.24,34.29 | U1.21 22.84,29.55 v22.86,29.53
  Top 0.406: L2.1 12.7,40.01 | L2.1 12.06,39.75 12.06,39.37 14.61,36.83 v15.24,36.83 | R19.2 R18.2 R17.2 27.3,27.3 25.4,29.21 23.18,29.21 v22.86,29.53 | C5.+ L2.1
  Bottom 0.406: C114.1 14.61,37.47 v15.24,36.83 v15.24,34.29 | v19.05,29.53 C108.1 | C106.1 v22.86,29.53 22.84,29.55 20.98,29.55 v20.95,29.53 | v19.05,29.53 18.1,29.53 v15.88,31.75 15.24,32.38 | v19.05,29.53 v20.95,29.53 | C109.1 15.24,32.38 | C110.1 14.02,34.88 14.61,34.29 v15.24,34.29 | v15.24,34.29 15.24,32.38 | C107.1 21.54,27.99 20.95,28.57 v20.95,29.53
+3V3  (via drill 0.6)
  Top 0.254: L2.2 17.14,40.01 18.41,38.73 20.95,38.73 24.45,35.24 v24.45,34.29 26.02,34.29 U1.28
  Top 0.406: X12.1 79.38,5.08 78.11,6.35 78.11,8.26 73.66,12.7 SV3.3 63.5,12.7 59.69,8.89 59.69,6.35 58.42,5.08 SV5.1 55.88,5.08 54.93,6.03 54.93,12.06 53.66,13.34 48.26,13.34 46.99,14.61 46.99,25.4 v47.62,26.04 | v39.37,58.74 39.4,58.71 IC2.2 39.37,56.52 39.37,53.98 40.03,53.32 D2.1 43.48,53.64 v44.45,54.61 | L2.2 15.62,48.9 | 15.62,48.9 15.62,49.27 17.14,50.8 17.61,50.8 R2.16 R2.15 R2.14 20.32,52.07 24.13,55.88 33.4,55.88 C3.+ | 60.04,51.44 IC3.3 60.01,50.48 59.69,50.16 49.53,50.16 48.26,51.44 48.26,53.34 v46.99,54.61 | C4.+ 15.49,49.02 15.62,48.9
  Bottom 0.406: C116.2 v39.37,58.74 39.05,58.42 36.2,58.42 33.66,55.88 C3.+ | v46.99,54.61 v44.45,54.61 | v47.62,26.04 47.62,29.84 44.13,33.34 35.24,33.34 33.02,35.56 26.3,35.56 C111.1 24.5,34.29 v24.45,34.29
+5V  (via drill 0.6)  (1 unrouted)
  Top 0.406: SV1.2 45.09,59.05 45.09,56.52 | IC6.16 v44.45,3.17 | C21.1 40.37,16.51 43.81,16.51 44.13,16.2 IC5.5 44.13,13.33 v44.45,13.02 | C21.1 39.73,16.14 | IC4.5 39.07,15.21 C21.1 | 45.09,56.52 45.06,56.54 IC2.3 41.27,56.95 41.27,59.05 40.01,60.33 38.1,60.33 37.08,59.31 C2.+ 29.59,59.31 IC1.3 24.77,60.33 24.77,57.78 20.32,53.34 17.14,53.34 | IC3.5 58.1,54.61 v57.47,55.24 56.52,56.2 53.66,56.2 53.02,55.56 | X4.1 8.89,53.34 10.79,51.44 15.88,51.44 17.14,52.7 17.14,53.34 | 17.14,53.34 17.14,55.35 D1.1 17.08,53.4 17.14,53.34 | 45.76,55.24 45.72,55.2 D2.3 44.77,51.48 44.77,48.58 43.82,47.63 Q2.2 43.77,45.77 v46.35,43.18 46.35,41.59 R11.2 | 45.76,55.24 45.72,55.24 45.09,55.88 45.09,56.52 | R24.2 73.97,29.23 | 73.97,29.23 R23.2 | R12.2 66.99,40.96 65.41,42.55 61.91,42.55 60.64,41.27 D4.2 60.5,39.69 60.5,39.54 60.33,39.37 58.1,39.37 57.15,38.42 57.17,38.39 U2.2 57.17,35.59 v57.15,35.56 | U2.44 57.34,35.75 v57.15,35.56 | U2.14 50.02,34.15 v50.16,34.29 50.8,34.92 | v57.15,35.56 51.44,35.56 50.8,34.92 | v57.15,27.94 57.34,27.75 U2.34 60.52,27.75 60.96,27.3 62.23,27.3 62.87,27.94 66.04,27.94 | v57.15,27.94 v57.15,35.56 | v57.15,27.94 55.88,29.21 52.07,29.21 v50.8,27.94 50.77,27.91 U2.24 50.77,24.74 50.16,24.13 48.9,24.13 47.94,23.18 v47.94,15.24 | 50.8,34.92 v48.26,37.47 | 53.02,55.56 52.7,55.24 R4.1 | 45.76,55.24 46.35,55.24 46.99,55.88 50.16,55.88 50.8,56.52 52.07,56.52 53.02,55.56 | 73.97,29.23 71.14,29.23 69.85,27.94 66.04,27.94 | T1.E 66.04,22.23 | 66.04,22.23 66.04,18.41 | 66.04,18.41 T3.E | 66.04,18.41 69.22,15.24 SV3.2 | 66.04,22.23 66.04,27.94
  Bottom 0.406: IC1.3 C117.2 | v50.16,34.29 51.39,34.29 C104.2 | v57.15,27.94 C102.2 | v50.8,27.94 C105.1 | v48.26,37.47 48.26,41.27 v46.35,43.18 | 44.45,5.35 C100.1 46.62,5.35 46.99,5.71 46.99,9.21 47.31,9.53 47.31,10.48 46.67,11.11 v44.45,13.02 46.67,15.24 v47.94,15.24 | 44.45,5.35 C101.1 | v44.45,3.17 44.45,5.35 | v57.15,35.56 C103.1 | C115.2 57.78,54.93 v57.47,55.24
ADC1
  Top 0.406: X7.2 77.47,40.64 75.56,38.73 75.56,35.56 74.93,34.92 71.12,34.92 70.48,34.29 70.48,31.11 69.22,29.84 63.82,29.84 61.11,32.55 U2.40
ALED
  Top 0.254: U1.27 27.15,33.81 27.62,33.34 27.62,32.7 28.26,32.07 33.02,32.07 37.47,27.62 37.47,22.23 40.01,19.68 42.55,19.68 43.18,19.05 IC5.2
CRXD  (via drill 0.6)
  Top 0.406: IC6.13 40.01,6.99 39.37,6.35 39.37,3.81 38.94,3.38 JMP2.1 36.72,3.38 v36.51,3.17
  Bottom 0.406: v36.51,3.17 29.84,3.17 29.21,2.54 26.67,2.54 SV4.4
CS_1  (via drill 0.6)
  Top 0.254: U1.32 27.42,36.31 v27.94,36.83
  Top 0.406: v54.61,27.94 55.56,26.99 55.56,25.96 U2.30
  Bottom 0.406: v54.61,27.94 53.66,28.89 49.85,28.89 44.45,34.29 35.56,34.29 33.34,36.51 28.26,36.51 v27.94,36.83
CTXD
  Top 0.406: SV4.3 26.67,5.08 32.38,5.08 34.09,3.38 JMP1.1 34.92,2.54 35.56,1.91 45.09,1.91 45.72,2.54 45.72,4.45 44.45,5.71 IC6.14
GND  (via drill 0.6)
  Top 0.254: 18.84,40.22 U1.48 18.21,40.64 v17.78,40.64 | U1.19 21.84,32.13 20.34,33.63 | 20.34,33.63 v19.68,34.29 | U1.14 19.34,33.95 v19.68,34.29 | U1.16 20.34,33.63 | U1.3 16.03,37.31 15.56,37.78 v15.56,38.42 | R9.1 12.38,31.43 | U1.9 19.66,34.31 v19.68,34.29 | U1.29 27.42,34.81 28.57,33.66 28.84,33.66 C9.2
  Top 0.406: R2.13 R2.12 R2.11 | R2.11 R2.10 R2.9 26.67,50.8 | R2.11 v24.13,52.7 | R1.2 v15.88,53.02 | C15.1 12.06,27.3 11.43,27.94 v11.43,28.26 | 12.38,31.43 v13.34,30.48 | R20.1 34.92,22.23 v34.29,21.59 33.66,20.95 C20.1 34,17.8 IC4.3 35.88,16.82 36.2,16.51 38.1,16.51 39.37,17.78 39.64,17.78 C21.2 40.35,17.8 IC5.3 | U2.23 49.45,25.95 v48.9,25.4 | C22.2 53.7,11.7 v53.02,12.38 48.79,12.38 IC6.8 47.94,12.06 | C10.2 45.09,36.83 v44.45,37.47 | C11.1 45.09,29.21 v44.45,28.57 | C8.1 30.11,39.73 v31.43,39.69 | C9.2 30.75,33.29 v31.43,33.34 | U2.15 49.84,33.35 v50.16,33.02 | U2.43 61.3,34.95 v61.59,35.24 | U2.35 61.3,28.55 v61.59,28.26 | C14.2 v66.99,33.97 | L1.1 63.44,45.98 64.29,46.83 | 64.29,46.83 64.77,47.31 65.36,47.31 R5.2 | R8.2 73.03,45.72 D3.A | R3.2 50.16,53.98 v51.44,55.24 | v55.24,55.24 C7.2 56.24,52.7 58.42,52.7 59.05,52.07 IC3.2 | D4.1 62.55,40.95 v62.87,41.27 | C12.2 49.16,45.07 C6.- | IC2.1 37.11,55.84 34.92,53.66 33.72,53.66 C3.- | 64.14,62.87 v61.59,62.87 | IC6.10 v40.32,10.79 | IC6.15 v40.32,4.45 | R21.2 61.91,25.71 v62.23,26.04 | R36.1 v58.42,13.97 | v64.77,46.04 64.77,46.35 64.29,46.83 | C18.2 19.68,26.99 19.05,27.62 16.83,27.62 v16.51,27.94
  pour Bottom (isolate 0.305): 0,0 85.72,0 85.72,0.64 85.72,66.04 0.64,66.04 0,66.04
INT6
  Top 0.406: R12.1 R13.2 64.92,37.63 D4.3 61.51,37.55 U2.1
LLED
  Top 0.254: U1.25 26.56,32.81 27.94,31.43 32.7,31.43 36.83,27.3 IC4.2
MISO  (via drill 0.6)
  Top 0.254: U1.34 27.15,37.31 27.94,38.1 27.94,40.64 29.21,41.91 39.69,41.91 40.32,41.27 v40.32,40.32 40.32,40.01 41.59,38.73 49.53,38.73 49.98,38.29 U2.11
  Bottom 0.406: SV1.1 46.35,59.69 40.32,53.66 v40.32,40.32
MOSI  (via drill 0.6)
  Top 0.254: U1.35 27.02,37.81 27.3,38.1 27.3,40.96 28.89,42.55 40.01,42.55 v41.27,41.27 41.27,40.01 41.91,39.37 50.16,39.37 50.8,38.73 50.8,37.58 U2.10
  Bottom 0.406: SV1.4 49.53,60.96 49.53,59.05 48.26,57.78 48.26,53.98 47.62,53.34 42.86,53.34 42.23,52.7 42.23,49.21 41.27,48.26 v41.27,41.27
N$1
  Top 0.406: Q4.2 41.4,36.7 43.81,34.29 44.72,34.29 C10.1 45.35,33.66 46.04,33.66 47.14,32.55 U2.16
N$2
  Top 0.406: U2.17 45.45,31.75 C11.2 44.85,31.88 Q4.1
N$3
  Top 0.254: U1.5 15.99,36.31 15.56,35.88 11.75,35.88 10.48,34.61 10.48,30.48 13.02,27.94 13.97,27.94 14.61,27.3 C17.1
  Top 0.406: R15.1 14.65,26.35 C17.1
N$4
  Top 0.406: Q1.2 14.29,55.88 15.88,57.47 17.89,57.47 D1.3 18.1,57.68 18.1,58.42 | C1.+ 16.19,60.33 18.1,58.42 | 18.1,58.42 18.1,58.74 IC1.1
  Bottom 0.406: IC1.1 C118.1
N$5  (via drill 0.6)
  Top 0.254: U1.20 22.34,32.59 21.27,33.66 v21.27,34.29
  Bottom 0.406: C113.1 20.95,35.56 21.27,35.24 v21.27,34.29
N$6
  Top 0.254: U1.6 16.12,35.81 15.56,35.24 12.06,35.24 11.11,34.29 11.11,30.8 12.7,29.21 17.46,29.21 18.41,28.26 21.27,28.26 22.23,27.3 R16.1
  Top 0.406: R16.1 24.71,26.35 C19.1
N$7
  Top 0.254: U1.30 29.19,35.31 C9.1
  Top 0.406: C9.1 31.8,35.29 R10.2 32.7,35.88 36.2,32.38 Q3.2
N$8
  Top 0.406: R35.1 R36.2 | SV5.3 59.69,10.16 61.59,12.06 61.59,13.65 R36.2 | X11.1 74.93,15.24 73.66,13.97 R36.2
N$9  (via drill 0.6)
  Top 0.406: JMP1.2 34.29,5.08 v33.02,6.35 | v31.11,11.43 31.11,12.7 26.67,17.14 19.05,17.14 v16.51,19.68
  Bottom 0.406: v33.02,6.35 33.02,9.53 v31.11,11.43 | v16.51,19.68 15.24,19.68 14.61,20.32 11.43,20.32 11.43,21.68 X8.2
N$10
  Top 0.406: C20.2 30.21,16.14 27.94,18.41 T2.2 | 27.94,21.59 T2.2 | R18.1 29.84,24.13 27.94,22.23 T2.2
N$11
  Top 0.406: R1.1 Q1.1
N$12
  Top 0.254: U1.31 28.19,35.81 28.89,36.51 28.89,36.78 C8.2 29.21,37.15
  Top 0.406: C8.2 31.7,37.73 R10.1 34.48,37.78 Q3.1
N$13  (via drill 0.6)
  Top 0.254: U1.2 18.07,37.81 19.05,36.83 v19.05,36.2
  Top 0.406: T2.1 29.53,20.95 v30.48,20.95 32.38,22.86 R19.1
  Bottom 0.406: v19.05,36.2 18.41,35.56 18.41,33.34 20.32,31.43 24.13,31.43 27.62,27.94 27.62,23.81 27.94,23.18 27.94,21.91 28.89,20.95 v30.48,20.95
N$14
  Top 0.254: U1.38 23.84,41.3 24.45,41.91 25.4,41.91 26.67,43.18 R2.8
N$15
  Top 0.254: U1.23 23.84,30.14 24.13,29.84 27.3,29.84 28.26,30.8 32.38,30.8 34.92,28.26 R20.2
N$16
  Top 0.406: R15.2 19.64,24.45 C18.1 21.59,24.4 | 21.59,24.4 22.18,24.4 R16.2 | T2.7 21.59,24.4
N$17  (via drill 0.6)
  Top 0.254: U1.1 18.2,38.31 18.41,38.1 19.05,38.1 v19.37,37.78
  Top 0.406: T2.3 v26.67,22.86 26.67,23.82 R17.1
  Bottom 0.406: v26.67,22.86 26.67,27.94 24.13,30.48 20.32,30.48 17.46,33.34 17.46,35.88 v19.37,37.78
N$18
  Top 0.406: T2.6 22.86,22.5 C19.2
N$19
  Top 0.406: T2.16 29.21,9.53 28.57,8.89 27.3,8.89 26.04,7.62 24.77,7.62 24.13,6.99 24.13,5.71 23.5,5.08 21.59,5.08 | 21.59,5.08 SV4.7 | 21.59,5.08 21.59,2.54 20.95,1.91 5.8,1.91 X10.5
N$20  (via drill 0.6)
  Top 0.254: U1.22 23.34,33.17 22.86,33.66 v22.86,34.29
  Bottom 0.406: 22.86,35.24 22.91,35.24 | v22.86,34.29 22.86,35.2 22.91,35.24 | 22.91,35.24 C112.1
N$21
  Top 0.406: T2.14 26.67,9.53 26.04,8.89 24.13,8.89 22.86,7.62 19.05,7.62 SV4.9
  Bottom 0.406: SV4.9 8.26,6.35 6.99,7.62 X10.4
N$22  (via drill 0.6)
  Top 0.406: R29.1 v15.88,15.88 17.14,15.88 18.41,14.61 22.23,14.61 22.86,13.97 T2.11 22.86,9.53 22.23,8.89 17.78,8.89 16.51,7.62 16.51,5.08 SV4.10
  Bottom 0.406: X10.2 13.97,17.78 v15.88,15.88
N$23
  Top 0.406: R28.2 15.88,18.41 18.41,15.88 26.67,15.88 27.94,14.61 T2.15
N$24
  Top 0.406: X10.3 7.62,12.7 10.16,15.24 10.16,22.86 11.43,24.13 11.79,24.13 C15.2 12.06,24.13 13.97,22.23 13.97,21.32 C16.1
N$25
  Top 0.254: U1.39 23.34,41.76 24.45,42.86 24.77,42.86 25.4,43.5 R2.7
N$26  (via drill 0.6)
  Top 0.406: JMP2.2 37.78,5.08 v36.51,6.35 | v32.38,12.06 32.38,12.7 26.67,18.41 19.68,18.41 v17.14,20.95
  Bottom 0.406: v36.51,6.35 36.51,7.94 v32.38,12.06 | X8.1 6.35,31.75 8.57,29.21 8.57,26.99 12.38,23.18 14.92,23.18 v17.14,20.95
N$27  (via drill 0.6)
  Top 0.406: v31.11,6.99 33.02,8.89 35.56,8.89 36.83,10.16 R33.2
  Bottom 0.406: SV4.2 v31.11,6.99
N$28
  Top 0.254: U1.10 16.03,33.81 15.24,33.02 15.24,32.38 14.61,31.75 14.6,31.75 R9.2
N$29
  Top 0.406: U2.42 62.37,34.15 64.14,32.38 C14.1
N$30
  Top 0.254: U1.40 22.84,42.21 24.13,43.5 R2.6
N$31
  Top 0.254: U1.41 22.34,42.66 22.86,43.18 R2.5
N$32
  Top 0.254: U1.42 21.84,44.03 R2.4
N$33
  Top 0.406: T2.8 19.37,20.64 17.14,22.86 15.24,22.86 14.61,23.5 C17.2
N$34
  Top 0.254: U1.43 21.34,42.16 20.32,43.18 R2.3
N$35
  Top 0.254: U1.44 20.84,41.71 20,42.55 19.68,42.55 19.05,43.18 R2.2
N$36
  Top 0.254: U1.45 20.34,41.26 19.68,41.91 18.41,41.91 17.78,42.55 R2.1
N$37
  Top 0.406: C16.2 12.34,18.46 R28.1 R29.2 R30.2 R31.1
N$38  (via drill 0.6)
  Top 0.406: X3.1 79.38,55.88 74.93,51.44 74.93,45.09 D3.C | v68.58,37.47 R13.1
  Bottom 0.406: D3.C 71.75,40.64 v68.58,37.47
N$39
  Top 0.406: T2.10 21.59,10.79 20.95,10.16 14.92,10.16 R31.2
N$40  (via drill 0.6)
  Top 0.406: R30.1 v17.14,13.34 19.37,13.34 T2.9
  Bottom 0.406: X10.1 6.99,22.86 10.79,19.05 14.61,19.05 17.14,16.51 v17.14,13.34 17.14,11.43 19.05,9.53 19.05,5.08 SV4.8
N$41
  Top 0.406: R33.1 38.42,13.97 40.99,13.97 IC5.4
N$42
  Top 0.406: IC4.4 34.29,13.65 R32.1
N$43
  Top 0.406: U2.33 57.98,25.21 59.05,24.13 R21.1
N$44
  Top 0.406: R26.1 78.74,22.86 79.38,23.5 82.87,23.5 83.5,24.13 83.5,42.23 82.55,43.18 79.38,43.18 78.11,44.45 78.11,50.16 78.74,50.8 X5.2
N$45
  Top 0.406: SV4.1 32.07,10.48 R32.2
N$46
  Top 0.406: R27.1 77.47,20.32 79.38,22.23 83.19,22.23 84.45,23.5 84.45,43.81 82.55,45.72 X5.1
N$48
  Top 0.406: IC6.3 50.12,5.71 C24.1
N$49
  Top 0.406: X2.2 69.38,55.08 70.48,53.98 SV2.2 R7.1 72.97,49.21 R8.1
N$50
  Top 0.406: C24.2 53.39,3.54 52.7,2.86 48.79,2.86 IC6.1
N$51
  Top 0.406: C23.2 51.39,7.57 50.8,6.99 IC6.4
N$52
  Top 0.406: IC6.5 49.53,8.26 50.48,9.21 52.7,9.21 53.34,8.57 53.34,7.67 C23.1
N$53
  Top 0.406: IC6.6 49.53,9.53 50.8,10.79 C22.1
N$54  (via drill 0.6)
  Top 0.406: IC6.2 46.99,4.45 45.72,5.71 45.72,8.57 v45.4,8.89
  Bottom 0.406: C100.2 v45.4,8.89
N$55
  Top 0.406: R26.2 67.46,22.86 T1.C
N$56
  Top 0.406: X2.3 68.58,54.61 67.94,53.98 SV2.3 R6.1 67.89,49.26 R5.1
N$57
  Top 0.406: R27.2 68.58,20.32 67.94,19.68 67.46,19.68 T3.C
N$58
  Top 0.406: R22.1 62.87,21.59 63.5,22.23 63.5,23.5 64.14,24.13 T1.B
N$59
  Top 0.406: R34.1 62.87,19.05 64.14,20.32 T3.B
N$61
  Top 0.406: U2.6 53.98,40.91 C13.2
N$63
  Top 0.406: R3.1 R4.2 55.2,51.76 C7.1 57.8,51.7 IC3.1
N$67  (via drill 0.6)
  Top 0.406: 43.81,49.53 Q2.1 v41.27,49.53 | IC3.4 60.01,54.93 57.47,57.47 47.31,57.47 v46.35,56.52
  Bottom 0.406: v46.35,56.52 44.45,56.52 41.27,53.34 v41.27,49.53
N$173
  Top 0.406: X9.2 78.11,30.48 75.56,33.02 R14.1
N$178
  Top 0.406: X9.1 R25.1
PB5  (via drill 0.6)
  Top 0.406: U2.29 54.77,24.3 v54.61,24.13
  Bottom 0.406: v54.61,24.13 54.61,23.5 50.16,19.05 22.23,19.05 16.19,25.08 13.02,25.08 10.48,27.62 10.48,30.16 8.57,32.07 8.57,39.77 X6.1
PC6
  Top 0.406: U2.31 56.38,21.09 58.42,19.05 R34.2
PC7
  Top 0.406: U2.32 57.17,23.47 59.05,21.59 R22.2
PD6  (via drill 0.6)
  Top 0.406: v52.39,19.68 52.39,25.94 U2.26
  Bottom 0.406: v52.39,19.68 50.8,18.1 21.91,18.1 15.88,24.13 12.7,24.13 9.53,27.3 9.53,29.84 7.62,31.75 7.62,35.65 X6.2
PD7
  Top 0.406: U2.27 53.17,20.48 55.24,18.41 57.15,18.41 59.05,16.51 R35.2
PF0  (via drill 0.6)
  Top 0.406: U2.41 61.58,33.35 64.14,30.8 68.58,30.8 69.53,31.75 v69.53,33.02
  Bottom 0.406: SV3.6 75.56,5.08 78.11,7.62 81.92,7.62 83.82,9.53 83.82,19.05 82.55,20.32 X11.2 83.19,20.32 84.45,21.59 84.45,31.75 83.19,33.02 v69.53,33.02
RES  (via drill 0.6)  (1 unrouted)
  Top 0.254: U1.37 24.45,40.01 28.26,43.81 40.96,43.81 43.18,41.59 v43.18,41.27 R11.1
  Top 0.406: U2.13 47.33,34.95 47.31,34.92 46.67,35.56 46.67,36.83 v46.04,37.47
  Bottom 0.406: SV1.5 52.7,59.69 50.16,57.15 50.16,53.34 47.94,51.12 44.77,51.12 44.13,50.48 44.13,48.58 43.18,47.62 v43.18,41.27 43.81,41.27 46.04,39.05 v46.04,37.47
RXD
  Top 0.406: JMP2.3 38.1,6.99 39.37,8.26 IC6.12 | U2.20 46.49,29.35 45.09,27.94 45.09,13.97 45.72,13.34 45.72,11.43 45.4,11.11 45.4,10.16 43.18,8.26 IC6.12 | 41.91,8.26 IC6.12
SCK  (via drill 0.6)
  Top 0.254: U1.33 25.1,36.81 24.45,37.47 24.45,38.42 25.4,39.37 25.4,40.01 28.57,43.18 40.64,43.18 42.23,41.59 v42.23,40.32 42.55,40.01 50.48,40.01 51.58,38.91 U2.9
  Bottom 0.406: SV1.3 50.8,59.05 49.21,57.47 49.21,53.66 47.62,52.07 44.45,52.07 43.18,50.8 43.18,48.9 42.23,47.94 v42.23,40.32
SCL  (via drill 0.6)
  Top 0.406: R24.1 72.39,27.3 | R25.2 R24.1 | U2.18 51.91,30.95 v52.07,31.11 | v67.31,26.67 69.85,26.67 71.12,27.94 R24.1
  Bottom 0.406: v52.07,31.11 52.7,31.11 53.02,30.8 60.96,30.8 61.28,31.11 62.87,31.11 v67.31,26.67
SDA  (via drill 0.6)
  Top 0.406: R14.2 R23.1 71.12,30.48 69.53,28.89 63.18,28.89 62.23,29.84 v61.59,29.84 | v50.8,29.84 50.48,29.84 50.16,30.16 48.19,30.16 U2.19
  Bottom 0.406: v61.59,29.84 v50.8,29.84
TXD  (via drill 0.6)
  Top 0.406: IC6.11 39.37,9.53 38.1,8.26 36.2,8.26 35.56,7.62 35.56,7.42 JMP1.3 | U2.21 47.02,28.55 46.99,28.57 46.04,27.62 46.04,14.29 46.67,13.65 46.67,10.48 v46.35,10.16 | IC6.11 41.91,9.53 | IC6.11 43.18,9.53 44.45,10.79 v44.45,11.75
  Bottom 0.406: v44.45,11.75 v46.35,10.16
UGND
  Top 0.406: U2.5 54.77,39.53 55.24,40.01 55.24,40.91 C13.1 55.88,41.55 55.56,41.59 60.96,46.99 60.96,48.26 61.98,49.27 L1.2 62.87,50.16 SV2.4 65.41,53.34 66.98,54.91 X2.5
USB+
  Top 0.406: U2.4 55.58,39.06 57.15,40.64 57.15,41.91 59.69,44.45 65.41,44.45 67.63,46.67 67.63,46.99 R6.2
USB-
  Top 0.406: U2.3 56.38,38.59 58.1,40.32 58.1,41.59 60.01,43.5 65.72,43.5 67.31,45.09 69.22,45.09 70.48,46.35 R7.2
VCC  (via drill 0.6)
  Top 0.406: Q1.3 11.15,57.52 X1.1 3.81,63.5 1.91,61.59 1.91,6.99 3.81,5.08 13.34,5.08 v14.61,3.81
  Bottom 0.406: v14.61,3.81 16.51,1.91 20.95,1.91 21.59,2.54 21.59,5.08 SV4.5
VUSB
  Top 0.406: SV2.1 72.71,53.02 72.71,53.34 70.8,55.24 70.48,55.24 70.18,55.55 X2.1 70.18,58.73 69.85,59.05 69.22,59.05 67.31,60.96 65.72,60.96 65.41,60.64 63.82,60.64 62.23,59.05 62.23,53.34 62.87,52.7 62.87,51.44 59.69,48.26 59.69,46.99 57.78,45.09 C6.+ | C6.+ 51.18,41.29 C12.1 51.44,41.01 51.44,40.01 52.07,39.37 52.7,39.37 53.17,38.9 U2.7 | C6.+ 51.18,46.93 49.53,48.58 Q2.3

### Text on the board
Top: 1 | 1
Bottom: 1 | Arduino Leonardo | V1.0 | JP2014 | 1
tValues: +Ub (5...18V) | GND | GND | INT1 (Taster) | +5V | PC7 (LED) | GND | PC6 (LED) | PB5 | PF1 (ADC1) | PD6 | GND | RXD | I2C SDA | TXD | I2C SCL | RX- | FS20 Recv | RX+ | GND | +5V | FS20 Send | Schirm | +3V3 | IN | GND | GND | TX- | GND | GND | +3V3 | OUT | +3V3 | TX+